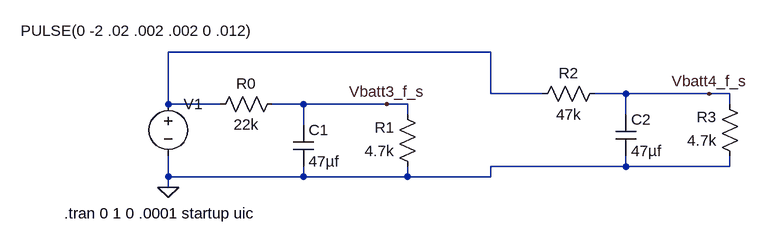
[diagram p0: schematic lpf_Vbatt4.asc]
lpf_Vbatt4.asc, the LTspice schematic file:
Version 4
SHEET 1 880 680
WIRE 464 16 -32 16
WIRE 464 80 464 16
WIRE 544 80 464 80
WIRE 672 80 624 80
WIRE 800 80 672 80
WIRE 832 80 800 80
WIRE -32 96 -32 16
WIRE 48 96 -32 96
WIRE 176 96 128 96
WIRE 304 96 176 96
WIRE 336 96 304 96
WIRE 832 96 832 80
WIRE 336 112 336 96
WIRE 672 112 672 80
WIRE 176 128 176 96
WIRE 672 192 672 176
WIRE 672 192 464 192
WIRE 832 192 832 176
WIRE 832 192 672 192
WIRE -32 208 -32 176
WIRE 176 208 176 192
WIRE 176 208 -32 208
WIRE 336 208 336 192
WIRE 336 208 176 208
WIRE 464 208 464 192
WIRE 464 208 336 208
WIRE -32 224 -32 208
FLAG -32 224 0
FLAG 304 96 Vbatt3_f_s
FLAG 800 80 Vbatt4_f_s
SYMBOL cap 160 128 R0
SYMATTR InstName C1
SYMATTR Value 47µf
SYMBOL voltage -32 80 R0
WINDOW 123 0 0 Left 0
WINDOW 39 0 0 Left 0
WINDOW 3 -227 -97 Left 2
SYMATTR Value PULSE(0 -2 .02 .002 .002 0 .012)
SYMATTR InstName V1
SYMBOL res 144 80 R90
WINDOW 0 0 56 VBottom 2
WINDOW 3 32 56 VTop 2
SYMATTR InstName R0
SYMATTR Value 22k
SYMBOL res 352 208 R180
WINDOW 0 36 76 Left 2
WINDOW 3 36 40 Left 2
SYMATTR InstName R1
SYMATTR Value 4.7k
SYMBOL cap 656 112 R0
SYMATTR InstName C2
SYMATTR Value 47µf
SYMBOL res 640 64 R90
WINDOW 0 0 56 VBottom 2
WINDOW 3 32 56 VTop 2
SYMATTR InstName R2
SYMATTR Value 47k
SYMBOL res 848 192 R180
WINDOW 0 36 76 Left 2
WINDOW 3 36 40 Left 2
SYMATTR InstName R3
SYMATTR Value 4.7k
TEXT -192 264 Left 2 !.tran 0 1 0 .0001 startup uic

The netlist it stands for:
* lpf_Vbatt4.asc
C1 Vbatt3_f_s 0 47µf
V1 N001 0 PULSE(0 -2 .02 .002 .002 0 .012)
R0 Vbatt3_f_s N001 22k
R1 0 Vbatt3_f_s 4.7k
C2 Vbatt4_f_s 0 47µf
R2 Vbatt4_f_s N001 47k
R3 0 Vbatt4_f_s 4.7k
.tran 0 1 0 .0001 startup uic
.backanno
.end